# EAGLE design PriusPP-esp12e (EAGLE 9.6.2)
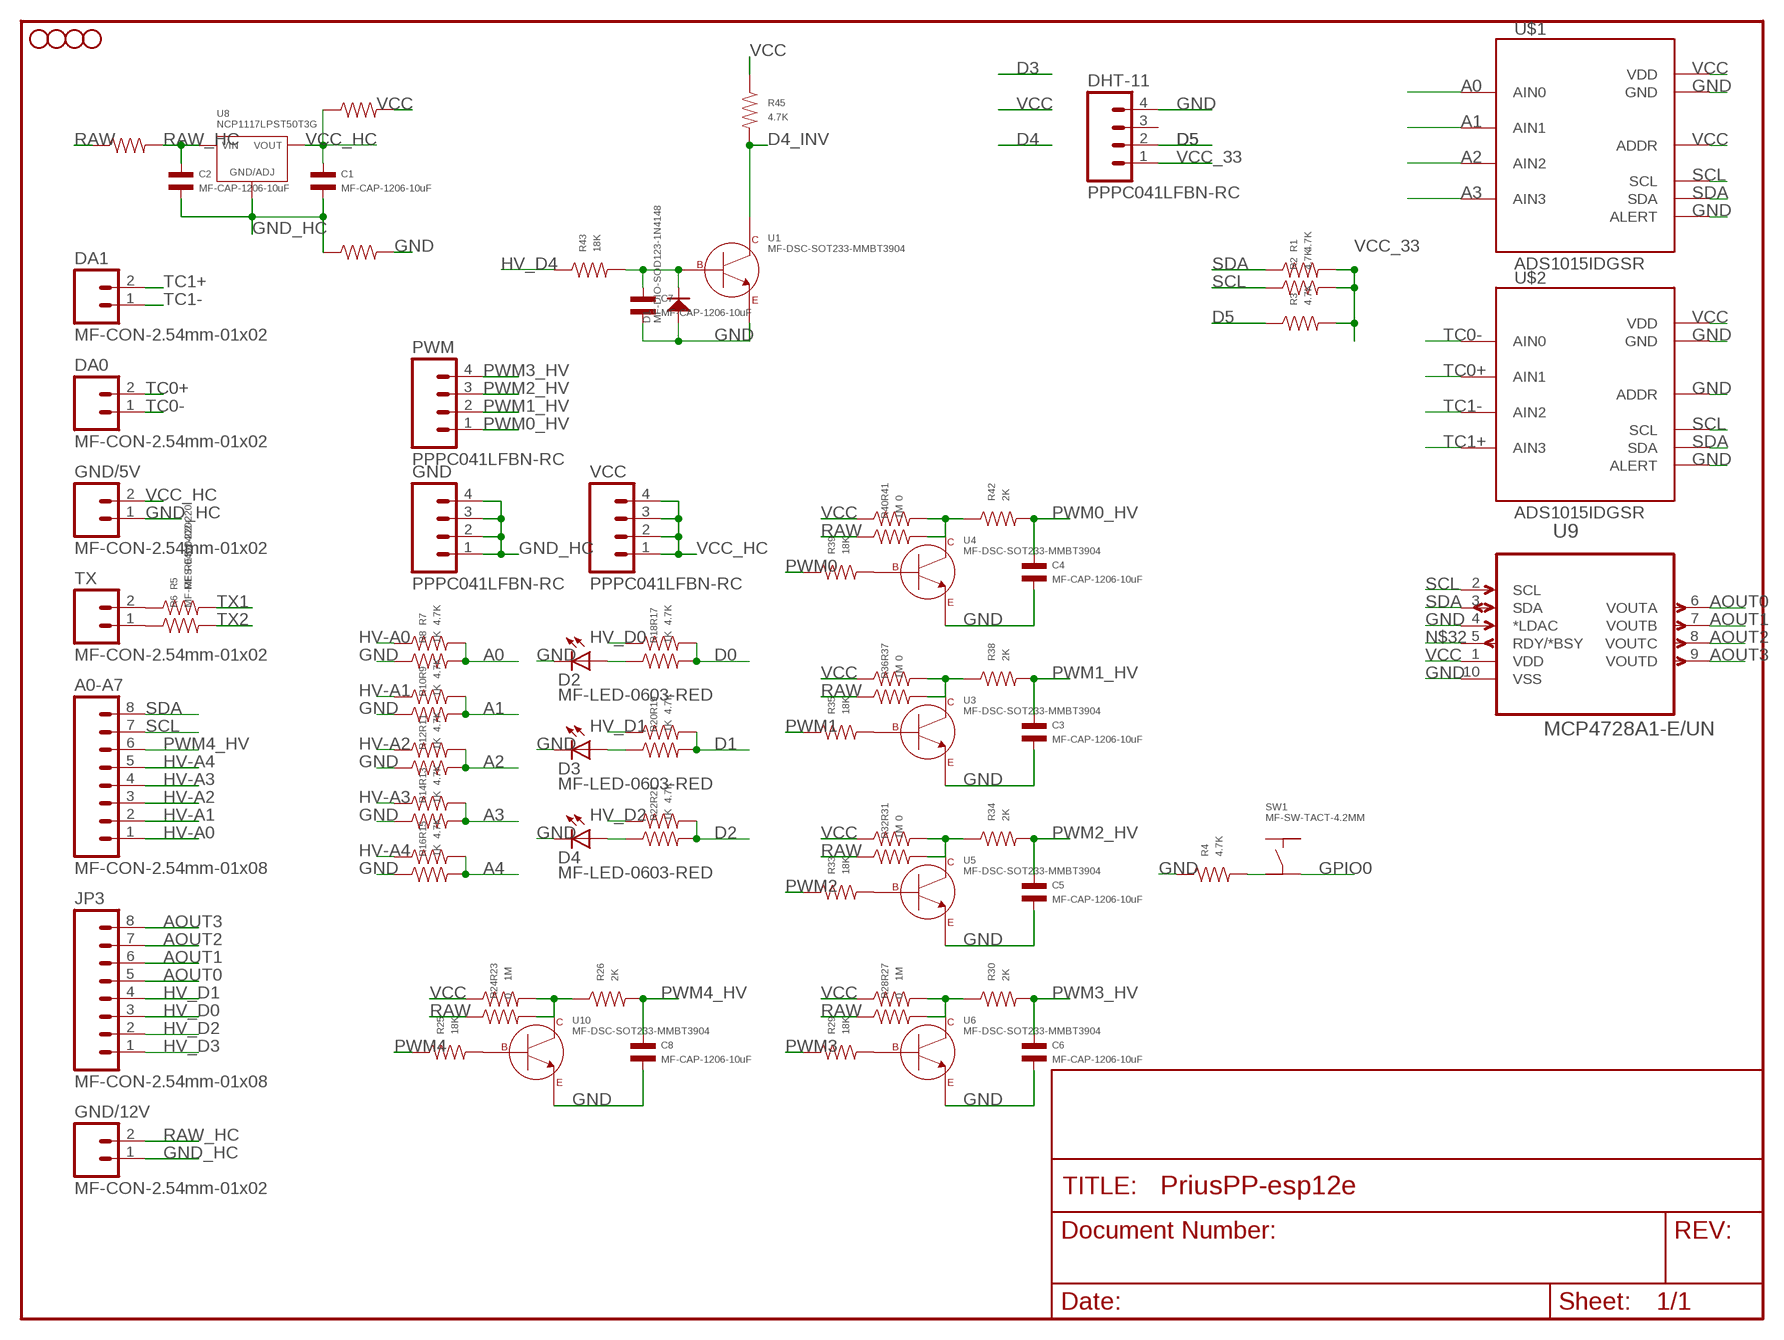
[diagram p0: schematic, sheet 1]

## Parts
A0-A7  MF-CON-2.54mm-01x08  M081X08  [1X08]
C1  MF-CAP-1206-10uF  CAPACITOR_NP_1206  [C1206]
C2  MF-CAP-1206-10uF  CAPACITOR_NP_1206  [C1206]
C3  MF-CAP-1206-10uF  CAPACITOR_NP_1206  [C1206]
C4  MF-CAP-1206-10uF  CAPACITOR_NP_1206  [C1206]
C5  MF-CAP-1206-10uF  CAPACITOR_NP_1206  [C1206]
C6  MF-CAP-1206-10uF  CAPACITOR_NP_1206  [C1206]
C7  MF-CAP-1206-10uF  CAPACITOR_NP_1206  [C1206]
C8  MF-CAP-1206-10uF  CAPACITOR_NP_1206  [C1206]
D1  MF-DIO-SOD123-1N4148  DIODES_1N4148_SOD-123  [SOD-123]
D2  MF-LED-0603-RED  LED-RED0603  [LED-0603]
D3  MF-LED-0603-RED  LED-RED0603  [LED-0603]
D4  MF-LED-0603-RED  LED-RED0603  [LED-0603]
DA0  MF-CON-2.54mm-01x02  M02PTH  [1X02]
DA1  MF-CON-2.54mm-01x02  M02PTH  [1X02]
DHT-11  PPPC041LFBN-RC  M04PTH  [1X04]
GND  PPPC041LFBN-RC  M04PTH  [1X04]
GND/5V  MF-CON-2.54mm-01x02  M02PTH  [1X02]
GND/12V  MF-CON-2.54mm-01x02  M02PTH  [1X02]
JP3  MF-CON-2.54mm-01x08  M081X08  [1X08]
PWM  PPPC041LFBN-RC  M04PTH  [1X04]
R1  4.7K  RESISTOR_0402  [R0402]
R2  4.7K  RESISTOR_0402  [R0402]
R3  4.7K  RESISTOR_0402  [R0402]
R4  4.7K  RESISTOR_0402  [R0402]
R5  MF-RES-0402-220  RESISTOR_0402  [R0402]
R6  MF-RES-0402-220  RESISTOR_0402  [R0402]
R7  4.7K  RESISTOR_0402  [R0402]
R8  1K  RESISTOR_0402  [R0402]
R9  4.7K  RESISTOR_0402  [R0402]
R10  1K  RESISTOR_0402  [R0402]
R11  4.7K  RESISTOR_0402  [R0402]
R12  1K  RESISTOR_0402  [R0402]
R13  4.7K  RESISTOR_0402  [R0402]
R14  1K  RESISTOR_0402  [R0402]
R15  4.7K  RESISTOR_0402  [R0402]
R16  1K  RESISTOR_0402  [R0402]
R17  4.7K  RESISTOR_0402  [R0402]
R18  1K  RESISTOR_0402  [R0402]
R19  4.7K  RESISTOR_0402  [R0402]
R20  1K  RESISTOR_0402  [R0402]
R21  4.7K  RESISTOR_0402  [R0402]
R22  1K  RESISTOR_0402  [R0402]
R23  1M  RESISTOR_0402  [R0402]
R24  0  RESISTOR_0402  [R0402]
R25  18K  RESISTOR_0402  [R0402]
R26  2K  RESISTOR_0402  [R0402]
R27  1M  RESISTOR_0402  [R0402]
R28  0  RESISTOR_0402  [R0402]
R29  18K  RESISTOR_0402  [R0402]
R30  2K  RESISTOR_0402  [R0402]
R31  0  RESISTOR_0402  [R0402]
R32  1M  RESISTOR_0402  [R0402]
R33  18K  RESISTOR_0402  [R0402]
R34  2K  RESISTOR_0402  [R0402]
R35  18K  RESISTOR_0402  [R0402]
R36  1M  RESISTOR_0402  [R0402]
R37  0  RESISTOR_0402  [R0402]
R38  2K  RESISTOR_0402  [R0402]
R39  18K  RESISTOR_0402  [R0402]
R40  1M  RESISTOR_0402  [R0402]
R41  0  RESISTOR_0402  [R0402]
R42  2K  RESISTOR_0402  [R0402]
R43  18K  RESISTOR_0402  [R0402]
R45  4.7K  RESISTOR_0402  [R0402]
RIN7  MF-RES-0603-0  RESISTOR1206  [1206]
RIN8  MF-RES-0603-0  RESISTOR1206  [1206]
RIN19  MF-RES-0603-0  RESISTOR1206  [1206]
STANDOFF2  STAND-OFF  [STAND-OFF]
STANDOFF3  STAND-OFF  [STAND-OFF]
STANDOFF4  STAND-OFF  [STAND-OFF]
STANDOFF5  STAND-OFF  [STAND-OFF]
SW1  MF-SW-TACT-4.2MM  TACT_4.2MM  [TACT4.2MM]
TX  MF-CON-2.54mm-01x02  M02PTH  [1X02]
U1  MF-DSC-SOT233-MMBT3904  NPN_BJTMMBT3904_SOT-23-3  [SOT-23-3]
U3  MF-DSC-SOT233-MMBT3904  NPN_BJTMMBT3904_SOT-23-3  [SOT-23-3]
U4  MF-DSC-SOT233-MMBT3904  NPN_BJTMMBT3904_SOT-23-3  [SOT-23-3]
U5  MF-DSC-SOT233-MMBT3904  NPN_BJTMMBT3904_SOT-23-3  [SOT-23-3]
U6  MF-DSC-SOT233-MMBT3904  NPN_BJTMMBT3904_SOT-23-3  [SOT-23-3]
U8  NCP1117LPST50T3G  [SOT-223-3]
U9  MCP4728A1-E/UN  MCP4728-E/UN  [SOP50P490X110-10N]
U10  MF-DSC-SOT233-MMBT3904  NPN_BJTMMBT3904_SOT-23-3  [SOT-23-3]
U$1  ADS1015IDGSR  ADS1015IDGT  [MSOP10_0.5]
U$2  ADS1015IDGSR  ADS1015IDGT  [MSOP10_0.5]
VCC  PPPC041LFBN-RC  M04PTH  [1X04]

## Nets
A0: R7.P$2 R8.P$2 U$1.4(AIN0)
A1: R9.P$2 R10.P$2 U$1.5(AIN1)
A2: R11.P$2 R12.P$2 U$1.6(AIN2)
A3: R13.P$2 R14.P$2 U$1.7(AIN3)
A4: R15.P$2 R16.P$2
AOUT0: JP3.5 U9.6(VOUTA)
AOUT1: JP3.6 U9.7(VOUTB)
AOUT2: JP3.7 U9.8(VOUTC)
AOUT3: JP3.8 U9.9(VOUTD)
D0: R17.P$2 R18.P$2
D1: R19.P$2 R20.P$2
D2: R21.P$2 R22.P$2
D4_INV: R45.P$2 U1.P$3(COLLECTOR)
D5: DHT-11.2 R3.P$1
GND: C3.P$2 C4.P$2 C5.P$2 C6.P$2 C7.P$2 C8.P$2 D1.ANODE D2.C D3.C D4.C DHT-11.4 R4.P$1 R8.P$1 R10.P$1 R12.P$1 R14.P$1 R16.P$1 RIN8.2 U1.P$2(EMITTER) U3.P$2(EMITTER) U4.P$2(EMITTER) U5.P$2(EMITTER) U6.P$2(EMITTER) U9.4(*LDAC) U9.10(VSS) U10.P$2(EMITTER) U$1.2(ALERT) U$1.3(GND) U$2.1(ADDR) U$2.2(ALERT) U$2.3(GND)
GND_HC [ground]: C1.P$2 C2.P$2 GND.1 GND.2 GND.3 GND.4 GND/5V.1 GND/12V.1 RIN8.1 U8.P$2(GND/ADJ)
GPIO0: SW1.P$4
HV-A0: A0-A7.1 R7.P$1
HV-A1: A0-A7.2 R9.P$1
HV-A2: A0-A7.3 R11.P$1
HV-A3: A0-A7.4 R13.P$1
HV-A4: A0-A7.5 R15.P$1
HV_D0: JP3.3 R17.P$1
HV_D1: JP3.4 R19.P$1
HV_D2: JP3.2 R21.P$1
HV_D3: JP3.1
HV_D4: R43.P$1
N1: D3.A R20.P$1
N2: D4.A R22.P$1
N155: D2.A R18.P$1
N$1: R5.P$1 TX.2
N$2: R25.P$2 U10.P$1(BASE)
N$4: C7.P$1 D1.CATHODE R43.P$2 U1.P$1(BASE)
N$5: R29.P$2 U6.P$1(BASE)
N$6: R36.P$2 R37.P$2 R38.P$1 U3.P$3(COLLECTOR)
N$7: R6.P$1 TX.1
N$8: R33.P$2 U5.P$1(BASE)
N$9: R31.P$2 R32.P$2 R34.P$1 U5.P$3(COLLECTOR)
N$10: R35.P$2 U3.P$1(BASE)
N$11: R40.P$2 R41.P$2 R42.P$1 U4.P$3(COLLECTOR)
N$12: R39.P$2 U4.P$1(BASE)
N$13: R27.P$2 R28.P$2 R30.P$1 U6.P$3(COLLECTOR)
N$15: R23.P$2 R24.P$2 R26.P$1 U10.P$3(COLLECTOR)
N$16: R4.P$2 SW1.P$3
N$32: U9.5(RDY/*BSY)
PWM0: R39.P$1
PWM0_HV: C4.P$1 PWM.1 R42.P$2
PWM1: R35.P$1
PWM1_HV: C3.P$1 PWM.2 R38.P$2
PWM2: R33.P$1
PWM2_HV: C5.P$1 PWM.3 R34.P$2
PWM3: R29.P$1
PWM3_HV: C6.P$1 PWM.4 R30.P$2
PWM4: R25.P$1
PWM4_HV: A0-A7.6 C8.P$1 R26.P$2
RAW: R24.P$1 R28.P$1 R32.P$1 R36.P$1 R40.P$1 RIN19.1
RAW_HC [vcc]: C2.P$1 GND/12V.2 RIN19.2 U8.P$4(VIN)
SCL: A0-A7.7 R2.P$1 U9.2(SCL) U$1.10(SCL) U$2.10(SCL)
SDA: A0-A7.8 R1.P$1 U9.3(SDA) U$1.9(SDA) U$2.9(SDA)
TC0+: DA0.2 U$2.5(AIN1)
TC0-: DA0.1 U$2.4(AIN0)
TC1+: DA1.2 U$2.7(AIN3)
TC1-: DA1.1 U$2.6(AIN2)
TX1: R5.P$2
TX2: R6.P$2
VCC: R23.P$1 R27.P$1 R31.P$1 R37.P$1 R41.P$1 R45.P$1 RIN7.2 U9.1(VDD) U$1.1(ADDR) U$1.8(VDD) U$2.8(VDD)
VCC_33: DHT-11.1 R1.P$2 R2.P$2 R3.P$2
VCC_HC [vcc]: C1.P$1 GND/5V.2 RIN7.1 U8.P$1(VOUT) U8.P$3(VOUT) VCC.1 VCC.2 VCC.3 VCC.4
Unconnected: DHT-11.3 SW1.P$1 SW1.P$2

## Library data of the parts
A0-A7 JP3 = SparkFun-Connectors:M08: Header 8 Standard 8-pin 0.1" header. Use with straight break away headers (SKU : PRT-00116), right angle break away headers (PRT-00553), swiss pins (PRT-00743), machine pins (PRT-00117), and female headers (PRT-00115).
C1-C8 = MF_Passives:CAPACITOR_NP: Library: MF_Passives Description: Device for Non-Polarized Capacitors. Manufacture part number (MPN) can be added via Attributes. Check https://factory.macrofab.com/parts for the house parts list.; POPULATE: 1
D1 = MF_Discrete_Semiconductor:DIODES: Library: MF_Discrete_Semiconductor Description: Device for Single Packaged Diodes.; HOUSEPART: YES; MPN: MF-DIO-SOD123-1N4148; POPULATE: 1; URL: https://factory.macrofab.com/part/MF-DIO-SOD123-1N4148
D2-D4 = SparkFun-LED:LED-RED: Assorted Red LEDs LilyPad 1206- DIO-09912 1206- DIO-00809 0603- DIO-00819; PROD_ID: DIO-00819; VALUE: RED
DA0 DA1 GND/5V GND/12V TX = SparkFun-Connectors:M02: Standard 2-pin 0.1" header. Use with - straight break away headers ( PRT-00116) - right angle break away headers (PRT-00553) - swiss pins (PRT-00743) - machine pins (PRT-00117) - female headers (PRT-00115) Molex polarized connector foot print use with: PRT-08233 with associated crimp pins and housings. 2.54_SCREWTERM for use with PRT-10571. 3.5mm Screw Terminal footprints for PRT-08084 5mm Screw Terminal footprints for use with PRT-08433
DHT-11 GND PWM VCC = SparkFun-Connectors:M04: Header 4 Standard 4-pin 0.1" header. Use with straight break away headers (SKU : PRT-00116), right angle break away headers (PRT-00553), swiss pins (PRT-00743), machine pins (PRT-00117), and female headers (PRT-00115). Molex polarized connector foot print use with SKU : PRT-08231 with associated crimp pins and housings. 1MM SMD Version SKU: PRT-10208
R1-R43 R45 = MF_Passives:RESISTOR: Library: MF_Passives Description: Device for Resistors. Manufacture part number (MPN), Voltage, Tolerance, and Wattage Rating can be added via Attributes. Check https://factory.macrofab.com/parts for the house parts list.; POPULATE: 1
RIN7 RIN8 RIN19 = SparkFun:RESISTOR: Resistor Basic schematic elements and footprints for 0603, 1206, and PTH resistors.
STANDOFF2-STANDOFF5 = SparkFun-Electromechanical:STAND-OFF: #4 Stand Off This is the mechanical footprint for a #4 phillips button head screw. Use the keepout ring to avoid running the screw head into surrounding components. SKU : PRT-00447; POPULATE: 0
SW1 = MF_Switches:TACT: Library: MF_Switches Description: Device for Tact Switches. Manufacture part number (MFG#) can be added via Attributes.; HOUSEPART: YES; MPN: MF-SW-TACT-4.2MM; POPULATE: 1; URL: https://factory.macrofab.com/part/MF-SW-TACT-4.2MM
U1 U3-U6 U10 = MF_Discrete_Semiconductor:NPN_BJT: Library: MF_Discrete_Semiconductor Description: Device for Single NPN BJT Transistors. Manufacture part number (MFG#) can be added via Attributes.; HOUSEPART: YES; MPN: MF-DSC-SOT233-MMBT3904; POPULATE: 1; URL: https://factory.macrofab.com/part/MF-DSC-SOT233-MMBT3904
U8 = MF_IC_Power:NCP1117LP: Manufacturer Part #: NCP1117LP Manufacturer: ON Semiconductor Description: LDO Voltage Regulators; HOUSEPART: NO; MPN: NCP1117LPST50T3G; POPULATE: 1; URL: http://www.onsemi.com/pub_link/Collateral/NCP1117LP-D.PDF
U9 = GD_MCP4728:MCP4728-E/UN: IC, DAC, 12BIT, QUAD; MPN: MCP4728-E/UN; OC_FARNELL: 1800217; OC_NEWARK: 08R1808; PACKAGE: MSOP-10; SUPPLIER: MICROCHIP
U$1 U$2 = bt_adc:ADS1015: Ti ADS1015 12-bit ADC Ultra-Small, Low-Power, 12-Bit Analog-to-Digital Converter with Internal Reference The ADS1013, ADS1014, and ADS1015 are precision analog-to-digital converters (ADCs) with 12 bits of resolution offered in an ultra-small, leadless QFN-10 package or an MSOP-10 package. \ Source: http://focus.ti.com/docs/prod/folders/print/ads1015.html

## Net classes
0 default: width 0.254 mm
1 vcc: width 0.762 mm
2 ground: width 0.762 mm

## Board
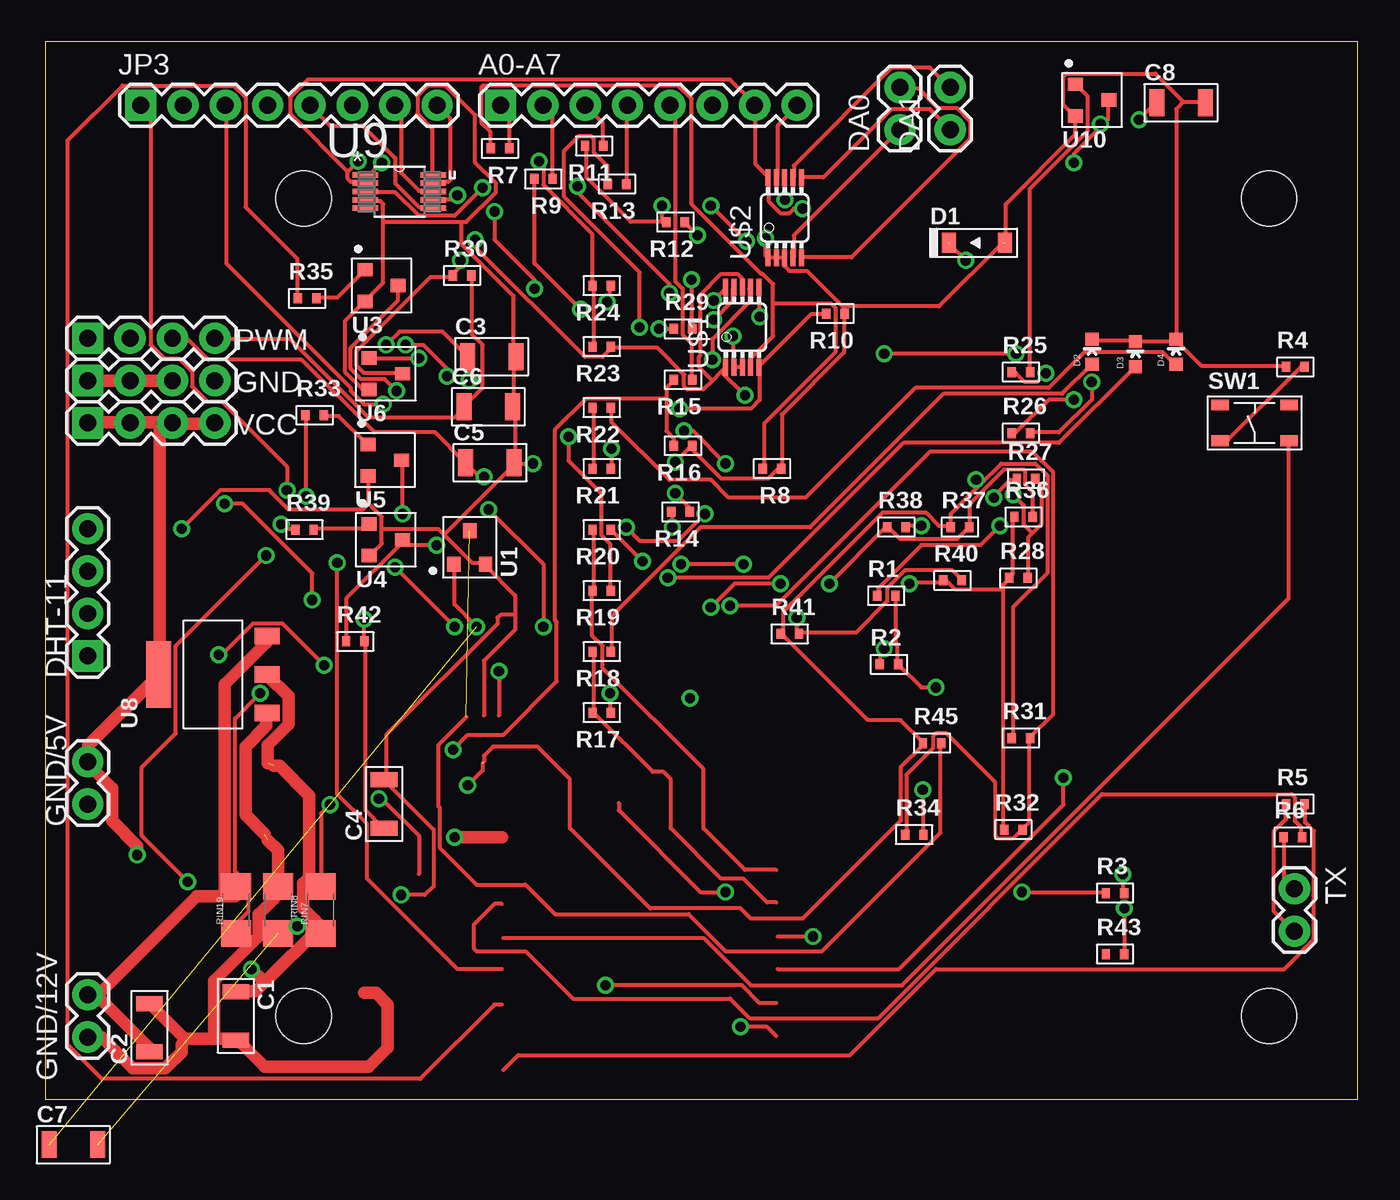
[diagram p1: board, top side]
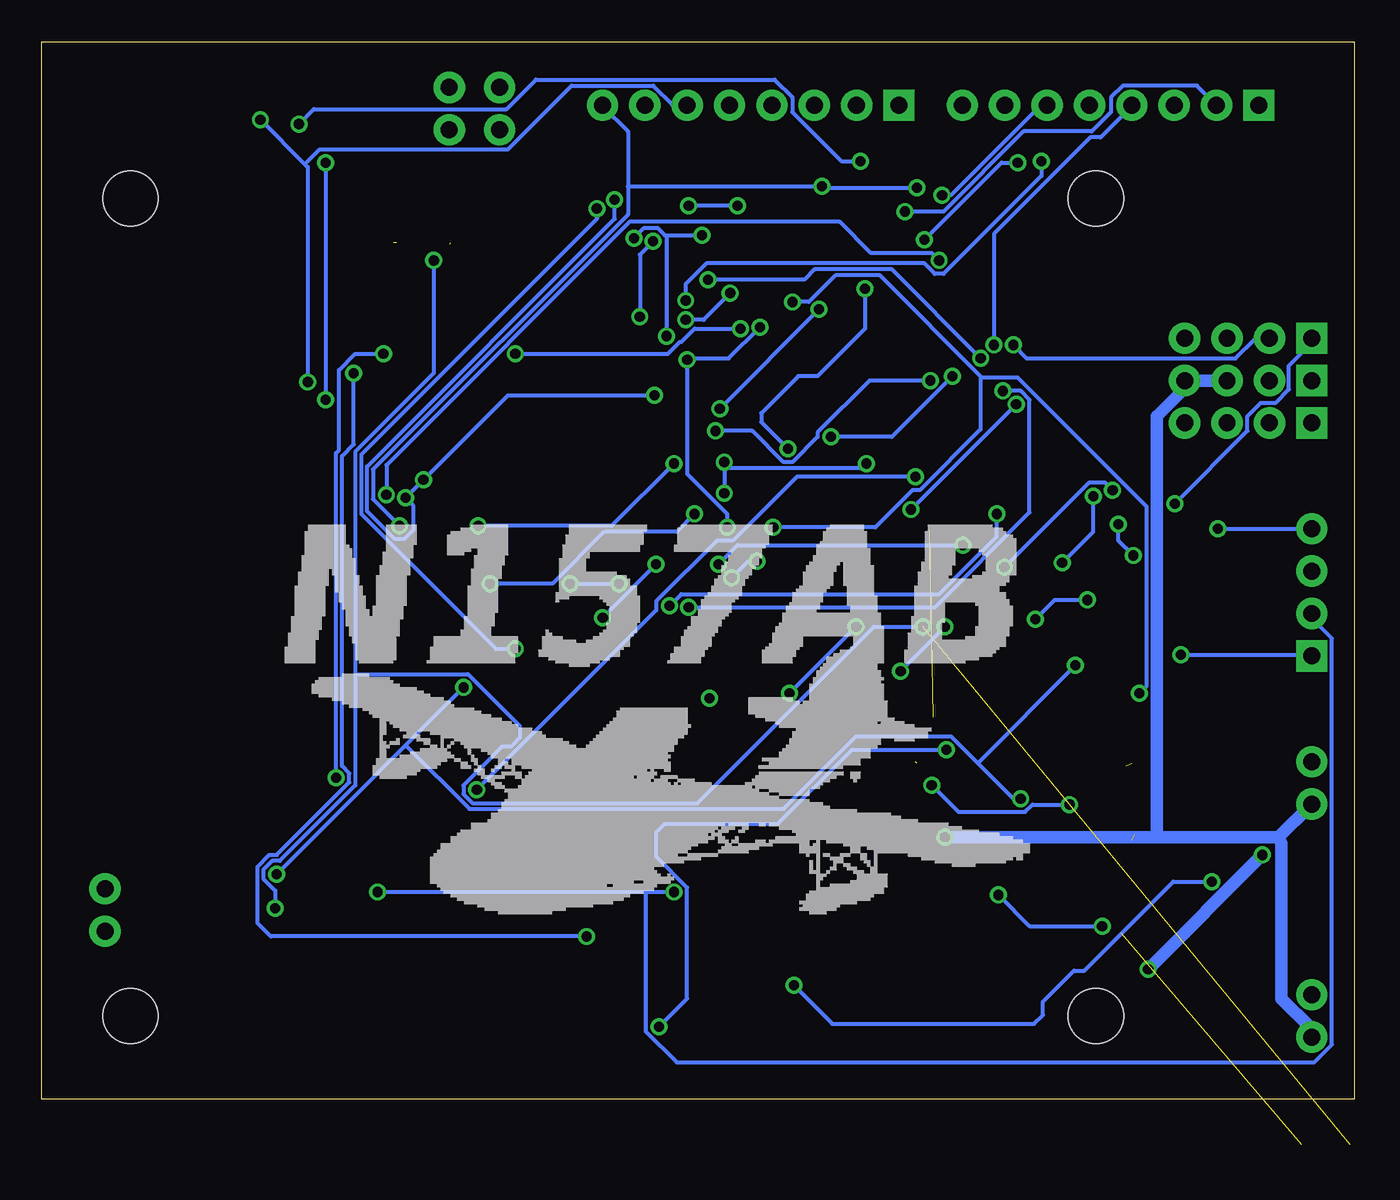
[diagram p2: board, bottom side, seen from below]

Size 78.73 x 63.42 mm. Coordinates in mm from the lower left corner, seen from the top.
Outline: 0,63.42 0,0 78.73,0 78.73,63.42 0,63.42
Copper layers (1*16): Top 0.035mm / dielectric 1.5mm / Bottom 0.035mm
Design rules "default *": minimum track width 10mil, minimum drill 24mil, track to track 4mil, track to pad 4mil, pad to pad 4mil, via to via 4mil, smd to smd 4mil, copper to edge 40mil, drill to drill 8mil, minimum pad ring 10mil, minimum via ring 8mil, stop-mask expansion 4mil, vias tented up to drill 0mil, thermal gap 10mil

### Footprints (pad centres in the part's own frame; a part is rotated, then mirrored left to right if it is on the bottom)
1X08 = drill 1.016 pad 1.88 square: 1 0,0 | drill 1.016 pad 1.88: 2 2.54,0; 3 5.08,0; 4 7.62,0; 5 10.16,0; 6 12.7,0; 7 15.24,0; 8 17.78,0
C1206 = smd 0.9 x 1.6: P$1 -1.45,0; P$2 1.45,0
SOD-123 = smd 0.85 x 1.2: ANODE 1.675,0; CATHODE -1.675,0
LED-0603 = smd 0.8 x 0.8: A 0,-0.75; C 0,0.75
1X02 = drill 1.016 pad 1.88: 1 0,0; 2 2.54,0
1X04 = drill 1.016 pad 1.88 square: 1 0,0 | drill 1.016 pad 1.88: 2 2.54,0; 3 5.08,0; 4 7.62,0
R0402 = smd 0.5 x 0.6: P$1 -0.55,0; P$2 0.55,0
1206 = smd 1.6 x 1.8: 1 -1.4,0; 2 1.4,0
STAND-OFF = hole 3.302: 0,0
TACT4.2MM = smd 1.05 x 0.65: P$1 -2.075,1.075; P$2 2.075,1.075; P$3 -2.075,-1.075; P$4 2.075,-1.075
SOT-23-3 = smd 0.9 x 0.8: P$1 -1,0.95; P$2 -1,-0.95; P$3 1,0
SOT-223-3 = smd 1.5 x 4: P$1 3.25,0 | smd 1.5 x 1: P$2 -3.25,2.3; P$3 -3.25,0; P$4 -3.25,-2.3
SOP50P490X110-10N = smd 1.524 x 0.33: 1 -2.032,0.991; 2 -2.032,0.508; 3 -2.032,0; 4 -2.032,-0.508; 5 -2.032,-0.991; 6 2.032,-0.991; 7 2.032,-0.508; 8 2.032,0; 9 2.032,0.508; 10 2.032,0.991
MSOP10_0.5 = smd 0.3 x 1.02: 1 -1,-2.4; 2 -0.5,-2.4; 3 0,-2.4; 4 0.5,-2.4; 5 1,-2.4; 6 1,2.4; 7 0.5,2.4; 8 0,2.4; 9 -0.5,2.4; 10 -1,2.4

### Placement (x,y rotation side)
A0-A7  27.3,59.61 0 top
C1  11.43,5 270 top
C2  6.25,4.29 90 top
C3  26.77,44.53 0 top
C4  20.32,17.7 90 top
C5  26.67,38.18 0 top
C6  26.57,41.53 0 top
C7  1.68,-2.72 0 top
C8  68.12,59.77 0 top
D1  55.88,51.36 0 top
D2  62.79,44.83 0 top
D3  65.38,44.68 0 top
D4  67.82,44.83 0 top
DA0  51.26,58.14 90 top
DA1  54.28,58.14 90 top
DHT-11  2.54,26.59 90 top
GND  2.54,43.1 0 top
GND/5V  2.54,17.7 90 top
GND/12V  2.54,3.73 90 top
JP3  5.71,59.61 0 top
PWM  2.54,45.64 0 top
R1  50.44,30.2 0 top
R2  50.6,26.09 0 top
R3  64.16,12.37 0 top
R4  74.98,43.92 0 top
R5  74.98,17.7 0 top
R6  74.83,15.72 0 top
R7  27.28,57.02 180 top
R8  43.59,37.82 180 top
R9  29.87,55.19 180 top
R10  47.4,47.12 180 top
R11  32.92,57.18 180 top
R12  37.8,52.6 180 top
R13  34.29,54.89 180 top
R14  38.1,35.23 180 top
R15  38.25,43.15 180 top
R16  38.25,39.19 180 top
R17  33.38,23.19 180 top
R18  33.38,26.85 180 top
R19  33.38,30.51 180 top
R20  33.38,34.16 180 top
R21  33.38,37.82 180 top
R22  33.38,41.48 180 top
R23  33.38,45.14 180 top
R24  33.38,48.79 180 top
R25  58.52,43.61 0 top
R26  58.52,39.95 0 top
R27  58.83,37.21 0 top
R28  58.37,31.27 0 top
R29  38.25,46.2 0 top
R30  24.99,49.4 0 top
R31  58.52,21.67 0 top
R32  58.06,16.18 0 top
R33  16.15,41.02 0 top
R34  52.12,15.88 0 top
R35  15.7,48.03 0 top
R36  58.67,34.93 0 top
R37  54.86,34.32 0 top
R38  51.05,34.32 0 top
R39  15.54,34.16 0 top
R40  54.41,31.12 0 top
R41  44.65,27.91 0 top
R42  18.59,27.46 0 top
R43  64.16,8.71 0 top
R45  53.19,21.36 0 top
RIN7  16.51,11.35 90 top
RIN8  13.97,11.35 270 top
RIN19  11.43,11.35 90 top
STANDOFF2  15.49,5 0 top
STANDOFF3  73.41,54.03 0 top
STANDOFF4  73.41,5 270 top
STANDOFF5  15.49,54.03 0 top
SW1  72.54,40.56 0 top
TX  74.93,12.62 270 top
U1  25.45,33.1 90 top
U3  20.17,48.79 0 top
U4  20.42,33.55 0 top
U5  20.37,38.33 0 top
U6  20.42,43.51 0 top
U8  10.06,25.48 180 top
U9  21.23,54.43 0 top
U10  62.79,59.92 0 top
U$1  41.81,46.3 0 top
U$2  44.35,52.86 0 top
VCC  2.54,40.56 0 top

### Tracks (layer width: path | path; a pad name or v marks a point on that pad's centre or on a via)
A0
  Top 0.254: 43.65,47.73 43.65,45.77 42.32,44.44 42.32,43.99 U$1.4 | 43.65,47.73 43.65,48.88 43.03,49.5 42.94,49.5 38.76,53.68 38.76,60 37.96,60.8 26.23,60.8 26.14,60.71 26.14,58.57 26.67,58.04 26.67,57.06 R7.P$2 | 43.65,47.73 47.12,47.73 47.38,47.46 47.38,44.79 43.12,40.53 43.12,37.86 R8.P$2
A1  (via drill 0.61)
  Top 0.254: R10.P$2 46.76,47.1 45.96,47.1 42.85,43.99 U$1.5 42.85,43.81 42.85,41.95 42.32,41.42 v38.05,41.42 | v32.09,47.37 29.34,50.13 29.34,55.19 R9.P$2
  Bottom 0.254: v38.05,41.42 v32.09,47.37
A2  (via drill 0.61)
  Top 0.254: 36.98,52.62 37.16,52.62 R12.P$2 | 36.98,52.62 35.12,52.62 32.45,55.28 32.45,57.15 R11.P$2 | v42.85,46.93 42.85,48.62 U$1.6 | v39.92,53.59 v42.05,51.46 | 36.98,52.62 v36.98,53.59
  Bottom 0.254: v42.85,46.93 42.85,50.66 v42.05,51.46 | v36.98,53.59 v39.92,53.59
A3  (via drill 0.61)
  Top 0.254: v37.6,34.3 37.6,35.19 R14.P$2 | v40.01,44.35 40.01,45.59 42.23,47.82 42.23,48.62 U$1.7 | v35.65,46.3 35.65,49.59 31.11,54.13 31.11,56.88 32,57.77 32.72,57.77 32.89,57.59 32.89,56.8 33.69,55.99 33.69,54.93 R13.P$2
  Bottom 0.254: v37.6,34.3 37.6,35.1 40.01,37.5 v40.01,44.35 39.92,44.44 37.52,44.44 v35.65,46.3
A4  (via drill 0.61)
  Top 0.254: 37.25,42.04 37.25,42.66 37.69,43.1 R15.P$2 | 37.25,42.04 37.25,40.08 37.69,39.64 R16.P$2 | 37.25,42.04 32.45,42.04 30.58,40.17 30.58,28.7 30.67,28.61 30.67,25.06 27.47,21.86 25.34,21.86 v24.45,20.97 | v41.69,4.34 43.29,4.34 43.83,3.81
  Bottom 0.254: v24.45,20.97 30.14,20.97 34.58,16.52 41.34,16.52 41.87,15.99 41.87,14.57 40.01,12.7 40.01,6.03 v41.69,4.34
AOUT0
  Top 0.254: U9.6 23.2,53.5 22.4,53.5 20.98,54.93 20.98,56.44 19.02,58.39 17.07,58.39 15.91,59.55 JP3.5
AOUT1  (via drill 0.61)
  Top 0.254: v24.71,54.22 24.45,53.95 23.29,53.95 U9.7
  Bottom 0.254: v24.71,54.22 24.18,54.22 18.85,59.55 18.49,59.55 JP3.6
AOUT2
  Top 0.254: U9.8 23.2,54.48 22.4,54.48 21.34,55.55 21.34,59.19 20.98,59.55 JP3.7
AOUT3
  Top 0.254: JP3.8 24.27,58.84 24.27,55.11 24.18,55.02 23.29,55.02 U9.9
D0
  Top 0.254: R18.P$2 32.89,26.84 32.89,23.19 R17.P$2 32.98,23.1 36.45,19.63 37.07,19.63 37.52,19.19 37.52,16.26 40.54,13.23 41.87,13.23 43.29,11.81 43.83,11.81
D1
  Top 0.254: R20.P$2 32.89,34.12 32.89,30.57 R19.P$2 32.8,30.39 32.8,27.81 33.43,27.19 33.43,25.86 39.47,19.81 39.47,16.26 41.96,13.77 43.83,13.77
D2
  Top 0.254: R21.P$2 32.89,37.86 32.89,41.42 R22.P$2
D4_INV  (1 unrouted)
  Top 0.254: 25.25,22.92 23.56,21.23 23.56,17.59 23.65,17.5 23.65,15.1 25.87,12.88 28.8,12.88 30.58,11.1 38.58,11.1 40.8,8.88 46.58,8.88 53.7,15.99 53.7,21.32 R45.P$2
D5  (via drill 0.61)
  Top 0.254: v58.59,12.43 63.56,12.43 R3.P$1 | v40.8,12.43 39.29,12.43 34.4,17.32 34.4,17.77
  Bottom 0.254: v40.8,12.43 42.49,12.43 | 42.49,12.43 v58.59,12.43 | 42.49,12.43 42.49,4.08 40.63,2.21 2.4,2.21 1.33,3.28 1.33,27.64 2.49,28.79 2.49,29.06 DHT-11.2
GND  (via drill 0.61)  (3 unrouted)
  Top 0.254: v37.78,36.35 38.58,35.55 38.58,35.28 R14.P$1 | v37.78,38.21 38.76,39.19 R16.P$1 38.76,39.02 40.54,37.24 43.38,37.24 43.92,37.77 44.09,37.77 R8.P$1 44.18,37.86 44.18,41.06 47.92,44.79 47.92,47.02 R10.P$1 47.92,47.19 47.92,47.46 | 47.92,47.46 45.7,49.68 44.63,49.68 44.36,49.95 44.36,50.39 U$2.3 44.27,50.48 43.92,50.48 U$2.2 43.83,50.48 43.47,50.48 U$2.1 43.29,50.48 43.2,50.57 v43.2,51.64 | U$1.3 41.78,43.9 41.34,43.9 U$1.2 41.25,43.99 v41.25,45.77 | v39.12,51.82 38.41,52.53 R12.P$1 | R4.P$1 74.41,43.99 69.34,43.99 67.83,45.5 D4.C | D4.C 67.74,45.42 65.43,45.42 D3.C 65.34,45.5 62.85,45.5 D2.C | 57.61,51.37 57.61,53.68 61.78,57.86 61.78,58.93 U10.P$2 61.7,59.02 61.07,59.64 61.07,61.33 61.25,61.51 66.59,61.51 68.28,59.82 | 68.28,59.82 69.52,59.82 C8.P$2 | 68.28,59.82 67.83,59.37 67.83,45.68 D4.C | 57.43,51.37 53.61,47.55 48.01,47.55 47.92,47.46 | U6.P$2 19.38,42.57 19.02,42.57 17.96,43.64 17.96,46.66 19.11,47.82 U3.P$2 19.2,47.91 20.27,48.97 20.27,52.62 | 20.27,52.62 20.27,53.68 20.09,53.86 19.2,53.86 U9.4 | 20.27,52.62 24.98,52.62 | 24.98,52.62 25.25,52.62 27.03,54.39 27.03,54.93 25.78,56.17 25.78,59.02 24,60.8 22.94,60.8 22.31,60.17 22.31,59.11 23.2,58.22 23.2,55.46 U9.10 | v15.11,10.39 15.02,10.48 14.05,10.48 RIN8.2 | v21.34,12.26 22.76,12.26 23.29,12.79 23.29,16.17 20.36,19.1 C4.P$2 20.45,19.19 20.45,21.86 27.11,28.52 27.11,28.88 27.29,29.06 28.18,29.06 | C5.P$2 28.18,38.21 28.18,41.5 C6.P$2 28.09,41.59 28.09,44.44 28.18,44.53 C3.P$2 28.09,44.61 28.09,48.17 24.98,51.28 24.98,52.62 | 19.38,35.72 19.38,37.33 U5.P$2 | 19.38,35.72 20.18,34.92 20.18,34.21
  Top 0.254: 20.18,34.21 20.18,33.33 19.47,32.61 U4.P$2 | 23.91,33.86 23.56,34.21 20.18,34.21 | 23.91,33.86 25.6,32.17 26.31,32.17 U1.P$2 26.4,31.99 28.18,30.21 28.18,29.06 | 26.31,23.01 26.31,26.3 28.18,28.17 28.18,29.06 | v8.18,34.21 10.49,36.53 13.42,36.53 14.58,35.37 19.02,35.37 19.38,35.72 | 23.91,33.86 28,37.95 28,38.13 C5.P$2 | v29.25,38.13 28.27,38.13 C5.P$2
  Bottom 0.254: v37.78,36.35 v37.78,38.21 37.69,37.86 29.52,37.86 v29.25,38.13 | 41.25,51.82 41.34,51.82 41.78,52.26 42.58,52.26 v43.2,51.64 | 41.25,51.82 v39.12,51.82 | 41.25,51.82 v41.25,45.77 | v15.11,10.39 19.47,10.39 v21.34,12.26 | v8.18,34.21 DHT-11.4
GND_HC  (via drill 0.61)  (1 unrouted)
  Top 0.762: 13.34,15.54 13.96,14.92 13.96,12.26 RIN8.1 13.69,11.99 12.8,11.1 12.8,9.77 10.13,7.1 10.13,3.63 | 13.16,15.9 12,17.06 12,21.15 13.25,22.39 13.25,23.1 U8.P$2 | 8.36,3.63 10.13,3.63 | 10.13,3.63 11.38,3.63 C1.P$2 11.73,3.37 13.16,1.94 19.38,1.94 20.54,3.1 20.54,5.68 19.82,6.39 19.11,6.39 | 8.36,3.63 6.31,5.68 C2.P$2 | GND/12V.1 2.58,3.72 3.38,3.72 5.25,1.85 7.2,1.85 8.18,2.83 8.18,3.28 8.36,3.63 | GND.1 GND.2 GND.3 | v24.54,15.72 27.38,15.72
  Bottom 0.762: GND.3 GND.4 10.31,42.75 10.31,42.48 11.82,40.97 11.82,15.72 | 4.53,15.72 11.82,15.72 | 11.82,15.72 v24.54,15.72 | 4.53,15.72 2.58,17.68 GND/5V.1 | GND/12V.1 2.58,3.81 2.58,4.25 4.36,6.03 4.36,15.37 4.53,15.72
GPIO0
  Top 0.254: 27.47,9.68 39.47,9.68 42.32,6.83 51.38,6.83 74.59,30.04 74.59,39.46 SW1.P$4
HV-A0
  Top 0.254: R7.P$1 27.83,57.06 27.83,59.11 27.38,59.55 A0-A7.1
HV-A1
  Top 0.254: R9.P$1 30.4,55.19 30.4,59.02 29.87,59.55 A0-A7.2
HV-A2
  Top 0.254: A0-A7.3 33.43,58.57 33.43,57.24 R11.P$1
HV-A3
  Top 0.254: R13.P$1 34.85,54.93 34.85,59.55 A0-A7.4
HV-A4
  Top 0.254: R15.P$1 38.76,43.19 38.76,45.33 38.23,45.86 38.23,48.62 37.78,49.06 37.78,59.28 37.52,59.55 A0-A7.5
HV_D0  (via drill 0.61)
  Top 0.254: v33.87,24.35 33.87,23.19 R17.P$1 | v29.87,28.35 29.87,32.08 v26.58,35.37 | v20.27,41.68 19.11,41.68 18.31,42.48 18.31,42.66 10.85,50.13 10.85,59.55 JP3.3
  Bottom 0.254: v29.87,28.35 v33.87,24.35 | v20.27,41.68 v26.58,35.37
HV_D1  (via drill 0.61)
  Top 0.254: v31.38,39.73 31.38,38.3 33.34,36.35 33.34,33.86 33.87,33.33 33.87,30.57 R19.P$1 | v24.09,43.37 24.09,43.81 22.67,45.24 v21.6,45.24
  Bottom 0.254: v31.38,39.73 27.74,39.73 v24.09,43.37 | v21.6,45.24 21.6,51.91 15.82,57.68 15.2,57.68 13.34,59.55 JP3.4
HV_D2  (via drill 0.61)
  Top 0.254: v33.96,39.02 33.96,37.86 R21.P$1 | v29.34,48.62 29.34,49.15 26.94,51.55 v26.94,53.24
  Bottom 0.254: v33.96,39.02 35.56,40.61 35.56,41.15 33.34,43.37 32.18,43.37 29.34,46.22 v29.34,48.62 | v26.94,53.24 24.62,53.24 19.82,58.04 15.73,58.04 14.58,59.19 14.58,60.08 13.87,60.8 9.42,60.8 8.27,59.64 JP3.2
HV_D3  (via drill 0.61)
  Top 0.254: v27.2,25.68 27.2,23.01 | v20.98,31.9 v24.54,28.35 | v14.49,36.53 14.49,37.95 10.58,41.86 9.69,41.86 8.8,42.75 8.8,43.64 8,44.44 7.11,44.44 6.31,45.24 6.31,59.02 JP3.1
  Bottom 0.254: v24.54,28.35 v27.2,25.68 | v20.98,31.9 15.91,36.97 14.94,36.97 v14.49,36.53
N1  (via drill 0.61)
  Top 0.254: v35.83,32.26 33.96,34.12 R20.P$1 | v37.34,31.28 43.38,31.28 51.47,39.37 60.81,39.37 65.34,43.9 D3.A
  Bottom 0.254: v35.83,32.26 36.36,32.26 v37.34,31.28
N2
  Top 0.254: R22.P$1 33.96,41.42 33.96,40.61 37.43,37.15 39.92,37.15 40.98,36.08 45.61,36.08 52.18,42.66 60.19,42.66 62.32,44.79 67.03,44.79 67.74,44.08 D4.A
N155
  Top 0.254: R18.P$1 33.96,26.92 33.96,28.97 39.29,34.3 45.87,34.3 53.87,42.3 60.98,42.3 62.76,44.08 D2.A
N$1
  Top 0.254: R5.P$1 74.41,17.68 74.41,16.79 73.7,16.08 73.7,11.28 74.85,10.12 TX.2
N$2
  Top 0.254: R25.P$2 59.03,43.64 59.03,54.57 62.5,58.04 62.5,60.17 61.87,60.8 U10.P$1
N$4  (via drill 0.61)  (2 unrouted)
  Top 0.254: v64.72,11.46 64.72,8.79 R43.P$2 | 54.23,51.28 v55.21,50.31 | v25.87,28.35 24.54,29.68 24.54,32.08 U1.P$1
  Bottom 0.254: v64.72,11.46 64.72,12.52 65.43,13.23 65.43,13.77 64.9,14.3 64.45,14.3 59.92,18.83 59.92,25.5 | 59.92,25.5 59.92,38.84 55.21,43.55 v55.21,50.31 | v25.87,28.35 28.8,28.35 39.38,17.77 52.9,17.77 53.43,18.3 53.43,18.83 51.12,21.15 50.58,21.15 50.05,21.68 50.05,22.39 53.16,25.5 59.92,25.5
N$5  (via drill 0.61)
  Top 0.254: v38.76,49.15 38.76,46.22 R29.P$2 | v22.4,44.44 19.47,44.44 U6.P$1
  Bottom 0.254: v38.76,49.15 32.98,49.15 32.36,49.77 27.74,49.77 v22.4,44.44
N$6  (via drill 0.61)
  Top 0.254: R36.P$2 59.21,34.92 59.21,36.44 58.76,36.88 58.76,37.68 58.67,37.77 57.52,37.77 55.47,35.72 55.47,34.39 R37.P$2 55.38,34.3 54.67,33.59 51.3,33.59 50.58,34.3 R38.P$1 50.41,34.3 v47.03,30.93 | v21.07,42.48 20.36,43.19 18.94,43.19 18.31,43.81 18.31,45.06 21.16,47.91 21.16,48.79 U3.P$3 | v39.92,29.5 41.34,30.93 v44.09,30.93
  Bottom 0.254: v21.07,42.48 20,42.48 19.47,41.95 19.47,35.19 25.16,29.5 v39.92,29.5 | v47.03,30.93 v44.09,30.93
N$7
  Top 0.254: TX.1 74.32,13.23 74.32,15.72 R6.P$1
N$8
  Top 0.254: R33.P$2 16.71,40.97 17.6,40.97 19.29,39.28 U5.P$1
N$9  (via drill 0.61)
  Top 0.254: R34.P$1 51.65,15.9 51.65,19.46 53.25,21.06 53.25,21.77 53.43,21.95 54.05,21.95 56.98,19.01 56.98,15.81 57.16,15.63 58.05,15.63 58.59,16.17 R32.P$2 58.67,16.26 59.03,16.61 59.03,21.59 R31.P$2 59.12,21.77 60.45,23.1 60.45,37.59 59.21,38.84 53.07,38.84 43.83,29.59 v41.07,29.59 | v21.43,35.1 21.43,38.3 U5.P$3
  Bottom 0.254: v21.43,35.1 21.43,33.77 24.89,30.3 40.36,30.3 v41.07,29.59
N$10
  Top 0.254: R35.P$2 16.27,48.08 17.51,48.08 19.11,49.68 U3.P$1
N$11  (via drill 0.61)
  Top 0.254: R42.P$1 18.05,30.04 21.34,33.33 21.34,33.5 U4.P$3 21.43,33.24 v23.47,33.24 | R40.P$2 54.94,31.19 54.41,31.72 51.56,31.72 50.49,30.66 50.49,29.86 48.63,27.99 45.25,27.99 R41.P$2 45.16,28.08 45.07,28.17 v45.07,28.88 | v41.87,32.08 v38.14,32.08
  Bottom 0.254: v23.47,33.24 36.98,33.24 v38.14,32.08 | v45.07,28.88 v41.87,32.08
N$12
  Top 0.254: R39.P$2 16.18,34.21 19.11,34.21 19.38,34.48 U4.P$1
N$13  (via drill 0.61)
  Top 0.254: 59.21,33.95 59.74,34.48 59.74,36.79 59.38,37.15 R27.P$2 | 59.21,33.95 58.94,33.68 58.94,31.28 R28.P$2 | U6.P$3 21.34,43.55 19.11,43.55 18.67,43.99 18.67,44.88 23.11,49.33 24.36,49.33 R30.P$1 24.45,49.5 24.89,49.95 v24.89,50.31 | 59.21,33.95 58.67,34.48 58.67,35.64 v58.05,36.26
  Bottom 0.254: v58.05,36.26 58.05,38.04 43.47,52.62 30.85,52.62 28.98,50.75 25.34,50.75 v24.89,50.31
N$14  (via drill 0.61)
  Top 0.254: 38.86,24.05 v38.66,24.05
  Bottom 0.254: 38.61,24.05 v38.66,24.05 38.73,24.05
N$15  (via drill 0.61)
  Top 0.254: R23.P$2 32.89,45.15 32.89,48.79 R24.P$2 32.8,48.88 32.8,51.91 29.87,54.84 29.87,55.99 v29.6,56.26 | v61.7,41.95 60.19,41.95 58.23,39.99 58.05,39.99 R26.P$1 | v61.7,56.17 61.7,56.71 63.39,58.39 | 63.39,58.39 63.74,58.75 63.74,59.91 U10.P$3 | v63.3,58.48 63.39,58.39
  Bottom 0.254: v61.7,56.17 v61.7,41.95 | v29.6,56.26 30.76,56.26 33.69,59.19 33.69,60.08 34.76,61.15 49.07,61.15 50.85,59.37 62.41,59.37 v63.3,58.48
N$16
  Top 0.254: R4.P$2 75.48,43.9 75.3,43.9 70.94,39.55 70.5,39.55 SW1.P$3
PWM0  (via drill 0.61)
  Top 0.254: v14.13,34.48 14.4,34.21 14.94,34.21 R39.P$1 | v13.25,32.61 7.82,27.19 7.82,21.95 5.78,19.9 5.78,15.81 v8.53,13.06 | v33.6,6.83 41.78,6.83 42.85,5.77 43.83,5.77
  Bottom 0.254: v14.13,34.48 14.13,33.5 v13.25,32.61 | v8.53,13.06 10.85,13.06 16.18,7.72 16.8,7.72 18.67,5.85 18.67,5.05 19.2,4.52 31.29,4.52 v33.6,6.83
PWM0_HV  (via drill 0.61)
  Top 0.254: C4.P$1 20.27,16.26 19.2,17.32 19.2,27.46 R42.P$2 19.11,27.55 v19.11,28.79 | v10.76,35.72 11.82,35.72 16,31.55 v16,29.95
  Bottom 0.254: v10.76,35.72 6.4,40.08 6.4,40.97 5.6,41.77 4.71,41.77 3.91,42.57 3.91,43.99 2.58,45.33 2.58,45.59 PWM.1 | v16,29.95 17.96,29.95 v19.11,28.79
PWM1
  Top 0.254: 27.38,5.68 26.94,5.68 22.49,1.23 3.38,1.23 1.33,3.28 1.33,57.51 4.62,60.8 11.29,60.8 12,60.08 12,53.5 15.11,50.39 15.11,48.08 R35.P$1
PWM1_HV  (via drill 0.61)
  Top 0.254: v52.54,34.39 51.65,34.39 R38.P$2 | v40.8,38.13 38.85,40.08 v38.32,40.08 | v25.43,43.1 25.43,44.44 25.34,44.53 C3.P$1 25.25,44.61 23.82,46.04 21.25,46.04 v20.45,45.24
  Bottom 0.254: v52.54,34.39 44.54,34.39 v40.8,38.13 | v38.32,40.08 36.09,40.08 34.23,38.21 33.69,38.21 32.18,39.73 32.18,39.99 29.07,43.1 v25.43,43.1 | v20.45,45.24 19.65,44.44 7.11,44.44 5.96,45.59 5.16,45.59 PWM.2
PWM2  (via drill 0.61)
  Top 0.254: v15.65,36.17 15.65,40.97 R33.P$1 | v17.51,32.17 17.51,18.3 19.29,16.52 19.29,13.23 24.71,7.81 27.38,7.81
  Bottom 0.254: v15.65,36.17 15.65,34.04 v17.51,32.17
PWM2_HV  (via drill 0.61)
  Top 0.254: v52.63,18.57 52.63,15.9 R34.P$2 | v26.31,37.33 26.05,37.33 25.25,38.13 C5.P$1 25.16,38.21 23.38,39.99 19.74,39.99 15.38,44.35 9.78,44.35 8.53,45.59 7.64,45.59 PWM.3
  Bottom 0.254: v52.63,18.57 41.87,29.32 41.87,29.86 38.23,33.5 37.25,33.5 33.43,37.33 v26.31,37.33
PWM3  (via drill 0.61)
  Top 0.254: v36.8,46.22 37.69,46.22 R29.P$1 | v58.23,44.7 v50.32,44.7 | v61.07,19.28 61.07,17.68 51.21,7.81 43.92,7.81
  Bottom 0.254: v36.8,46.22 39.56,46.22 40.36,45.42 40.45,45.42 41.16,44.7 v50.32,44.7 | v58.23,44.7 59.92,44.7 60.9,43.73 60.9,38.93 61.07,38.75 v61.07,19.28
PWM3_HV
  Top 0.254: R30.P$2 25.6,49.33 25.6,45.86 26.23,45.24 26.23,42.66 25.16,41.59 C6.P$1 25.07,41.42 24.54,40.88 19.38,40.88 14.67,45.59 10.22,45.59 PWM.4
PWM4  (via drill 0.61)
  Top 0.254: v60.01,43.55 59.47,43.02 58.76,43.02 58.23,43.55 58.05,43.55 R25.P$1 | 43.92,9.77 v46.05,9.77
  Bottom 0.254: v60.01,43.55 60.01,39.28 60.72,38.57 60.72,19.99 60.27,19.55 60.27,19.01 64.63,14.66 65.08,14.66 65.79,13.95 65.79,10.57 64.99,9.77 v46.05,9.77
PWM4_HV  (via drill 0.61)
  Top 0.254: v62.76,43.02 62.76,41.95 60.81,39.99 59.12,39.99 R26.P$2 | v65.61,58.75 66.59,59.73 C8.P$1
  Bottom 0.254: v62.76,43.02 62.76,55.91 62.94,56.08 | v65.61,58.75 62.94,56.08 | 62.94,56.08 62.05,56.97 50.76,56.97 46.94,60.8 42.05,60.8 40.89,59.64 40.01,59.64 A0-A7.6
RAW  (via drill 0.61)
  Top 0.254: 57.43,30.57 57.43,30.84 57.78,31.19 R28.P$1 57.87,31.37 58.05,31.55 58.05,34.92 R36.P$1 | 57.43,30.57 57.43,16.26 R32.P$1 | 57.43,30.57 54.59,30.57 54.05,31.1 53.87,31.1 R40.P$1 53.78,31.01 51.92,31.01 v51.83,30.93 | v33.69,47.82 33.87,47.99 33.87,48.79 R24.P$1 | v12.89,24.35 11.38,22.84 11.38,13.68 12.18,12.88 12.18,11.28 11.47,10.57 RIN19.1 | v39.56,35.1 37.96,33.5 35.65,33.5 v34.85,34.3
  Bottom 0.254: v33.69,47.82 32.72,47.82 31.11,49.42 28.45,49.42 22.31,43.28 | 22.31,43.28 20.18,43.28 12.45,35.55 12.45,24.79 v12.89,24.35 | v51.83,30.93 48.09,30.93 44.98,34.04 40.63,34.04 v39.56,35.1 | v34.85,34.3 28.71,34.3 26.49,36.53 26.05,36.53 22.4,40.17 22.4,43.19 22.31,43.28
RAW_HC
  Top 0.762: 10.76,12.17 9.07,12.17 3.2,6.3 2.58,6.3 GND/12V.2 3.38,5.94 6.22,3.1 6.22,2.92 C2.P$1 | 10.76,12.17 11.38,12.17 RIN19.2 | 10.76,12.17 10.76,24.88 13.25,27.37 13.25,27.72 U8.P$4
SCL  (via drill 0.61)
  Top 0.254: v40.09,47.91 40.8,48.62 U$1.10 | 18.14,55.64 v18.76,56.26 | 18.14,55.64 18.14,55.19 18.31,55.02 19.2,55.02 U9.2 | v50.32,27.01 50.05,26.75 50.05,26.12 R2.P$1 | v45.43,53.42 44.9,53.42 44.63,53.15 44.09,53.15 43.38,53.86 43.38,55.19 U$2.10 43.29,55.37 42.58,56.08 42.58,59.55 A0-A7.7 42.49,59.73 41.07,61.15 15.73,61.15 14.67,60.08 14.67,59.11 18.14,55.64
  Bottom 0.254: v40.09,47.91 40.09,48.88 38.85,50.13 25.78,50.13 25.16,49.5 24.62,49.5 18.76,55.37 v18.76,56.26 | v50.32,27.01 51.47,27.01 59.56,35.1 59.56,38.66 45.43,52.79 v45.43,53.42
SDA  (via drill 0.61)
  Top 0.254: v57.25,34.39 56.1,33.24 52.54,33.24 49.96,30.66 49.96,30.21 R1.P$1 | v40.09,46.75 41.25,47.91 41.25,48.62 U$1.9 | v37.43,48.35 37.43,48.88 31.91,54.39 v31.91,54.75 | U$2.9 43.92,55.28 43.92,58.39 45.07,59.55 A0-A7.8 | v26.23,54.66 24.54,52.97 22.4,52.97 20.98,54.39 19.2,54.39 U9.3
  Bottom 0.254: v57.25,34.39 58.85,35.99 58.85,37.77 43.56,53.06 43.56,54.75 | 43.56,54.75 43.56,58.04 45.07,59.55 A0-A7.8 | v40.09,46.75 39.03,46.75 v37.43,48.35 | 43.56,54.75 v31.91,54.75 31.83,54.66 v26.23,54.66
TC0+
  Top 0.254: U$2.5 45.43,50.48 48.36,50.48 55.47,57.59 55.47,58.66 54.67,59.46 53.52,59.46 52.36,60.62 51.3,60.62 DA0.2
TC0-
  Top 0.254: U$2.4 44.9,50.48 44.9,51.82 51.21,58.13 DA0.1
TC1+
  Top 0.254: U$2.7 44.9,55.28 44.9,55.99 50.76,61.86 53.07,61.86 54.23,60.71 DA1.2
TC1-
  Top 0.254: U$2.6 45.43,55.28 46.67,55.28 50.76,59.37 53.07,59.37 54.23,58.22 DA1.1
TX1
  Top 0.254: 27.47,1.77 28.36,2.65 48.27,2.65 53.43,7.81 74.32,7.81 76.1,9.59 76.1,16.08 75.56,16.61 75.56,17.68 R5.P$2
TX2
  Top 0.254: 27.38,11.72 26.94,11.72 25.69,10.48 25.69,9.05 25.87,8.88 28.8,8.88 31.65,6.03 41.07,6.03 42.23,4.88 49.96,4.88 63.39,18.3 74.77,18.3 74.94,18.12 74.94,16.7 75.3,16.34 75.3,15.72 R6.P$2
VCC  (via drill 0.61)  (1 unrouted)
  Top 0.254: 40.54,43.64 U$1.1 | 40.54,43.64 40.01,43.1 | 40.01,43.1 39.47,42.57 38.49,42.57 38.32,42.75 38.32,43.46 36.72,45.06 33.96,45.06 R23.P$1 33.87,44.97 33.43,44.53 32.36,44.53 25.78,51.11 v25.78,51.55 | 40.01,43.1 39.2,43.9 39.2,44.53 39.29,44.61 39.29,48.26 40.54,49.5 41.52,49.5 41.78,49.24 41.78,48.7 U$1.8 | v20.18,56.17 19.47,55.46 19.2,55.46 U9.1 | v17.07,17.68 16.54,17.14 16.54,12.26 RIN7.2 | v25.34,18.83 26.23,19.72 26.23,20.17 | 56.1,36.88 54.32,35.1 54.32,34.48 R37.P$1 54.23,34.39 53.61,34.39 52.81,35.19 50.23,35.19 44.27,29.24 44.27,27.99 R41.P$1 44.18,27.9 49.34,22.75 51.3,22.75 52.63,21.41 R45.P$1 52.63,21.23 51.3,19.9 51.3,16.7 45.43,10.83 42.32,10.83 41.69,11.46 36.27,11.46 31.47,16.26 31.47,19.19 29.52,21.15 26.85,21.15 26.31,20.61 26.31,20.26 | 56.1,36.88 57.34,38.13 59.38,38.13 60.1,37.41 60.1,31.55 58.05,29.5 58.05,21.68 R31.P$1 | v56.9,36.08 56.9,36.17 57.87,37.15 58.23,37.15 R27.P$1 | 56.1,36.88 v55.83,37.15 | v44.36,53.95 44.36,55.19 U$2.8 | v41.96,42.22 40.54,43.64
  Bottom 0.254: v20.18,56.17 21.16,56.17 v25.78,51.55 | v17.07,17.68 19.29,17.68 19.74,17.23 23.74,17.23 v25.34,18.83 | v44.36,53.95 44.36,52.79 59.21,37.95 59.21,35.28 57.52,33.59 56.98,33.59 56.45,34.12 56.45,35.64 v56.9,36.08 v55.83,37.15 50.76,42.22 v41.96,42.22
VCC_33  (via drill 0.61)
  Top 0.254: R1.P$2 51.03,30.12 51.03,27.37 51.12,27.28 51.12,26.12 R2.P$2 51.21,26.04 52.54,24.7 v53.43,24.7 | v64.63,13.5 64.63,12.43 R3.P$2 | 22.4,13.5 22.4,15.81 20.18,18.03 v20,18.03 | v10.4,26.66 10.58,26.66 12.45,28.52 14.22,28.52 v16.71,26.04
  Bottom 0.254: v53.43,24.7 56.9,21.23 | 56.9,21.23 v64.63,13.5 | v20,18.03 20.45,18.03 22.58,20.17 | 22.58,20.17 24.18,21.77 29.87,21.77 34.23,17.41 53.07,17.41 56.9,21.23 | v10.4,26.66 2.58,26.66 DHT-11.1 | 22.58,20.17 v16.71,26.04
VCC_HC  (via drill 0.61)  (1 unrouted)
  Top 0.762: 13.34,20.17 13.34,21.23 14.58,22.48 14.58,24.17 13.34,25.41 U8.P$3 | 13.16,7.01 12.62,6.48 11.47,6.48 C1.P$1 | 13.16,7.01 16.45,10.3 16.45,10.48 RIN7.1 16.18,10.74 15.47,11.46 15.47,12.97 15.82,13.32 15.82,18.21 14.05,19.99 13.69,19.99 | VCC.1 2.58,40.61 5.07,40.61 VCC.2 5.42,40.61 7.56,40.61 VCC.3 | VCC.4 10.13,40.53 8,40.53 VCC.3 | VCC.3 6.84,40.26 6.84,25.86 U8.P$1 6.76,25.41 2.58,21.23 2.58,20.26 GND/5V.2 2.76,19.9 4,18.66 4,16.7 5.51,15.19 v5.51,14.66 | v12.36,7.81 13.16,7.01
  Bottom 0.762: v5.51,14.66 v12.36,7.81